# Altium schematic sheet 4_preamp.SchDoc
size A; SheetNumber: 3; SheetTotal: 7
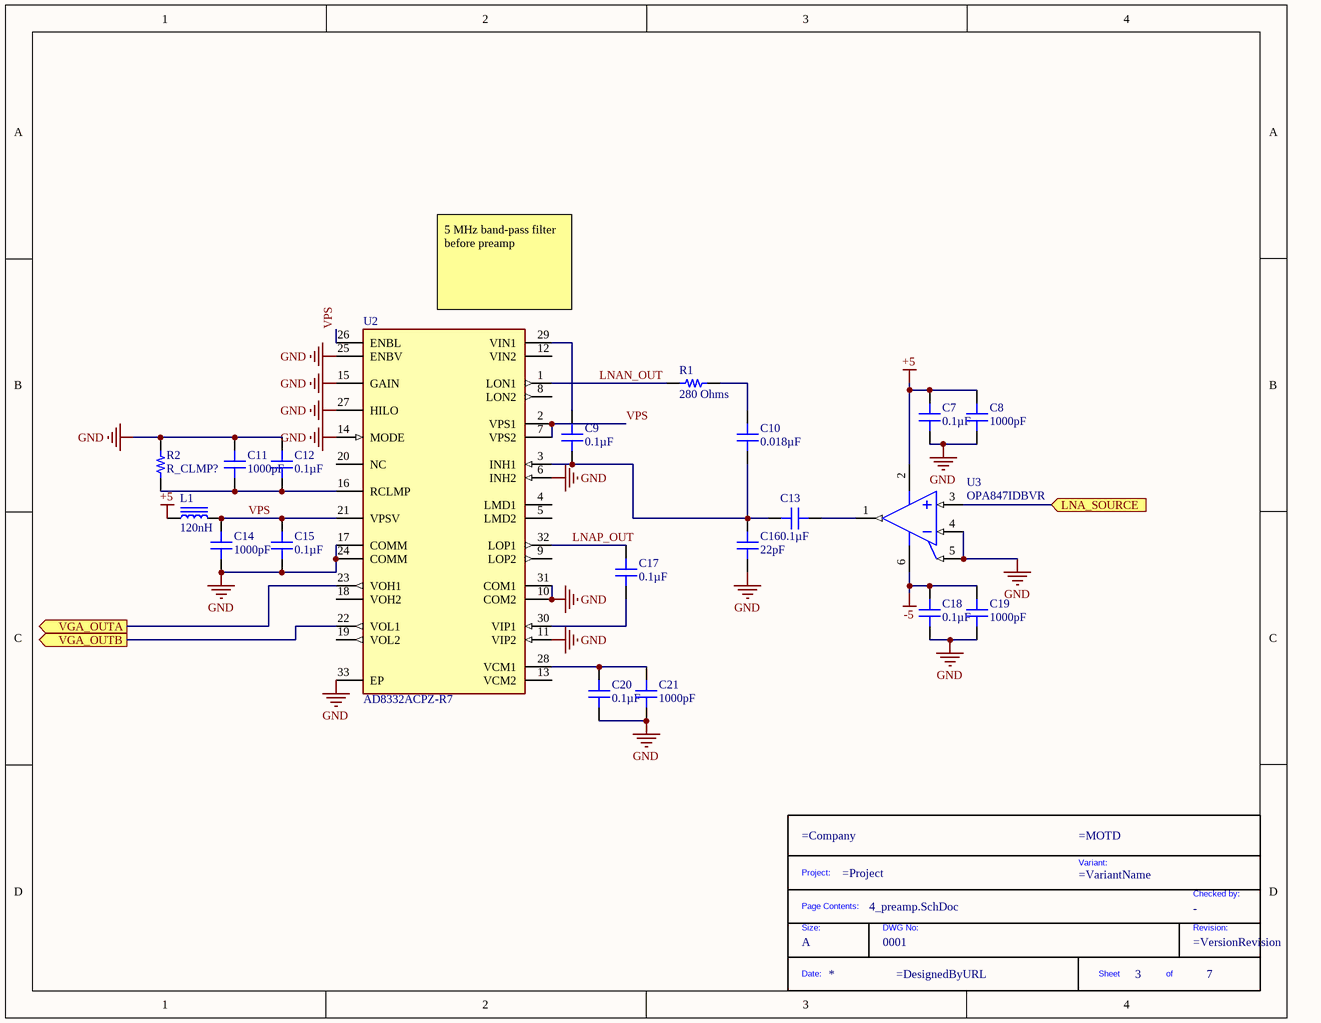
[diagram p0: 4_preamp.SchDoc]

## Parts
*?  DWG No: 0001  Size: A  (hidden comment: TitleBlock)  (graphical)
C7  0.1µF  [CAP 1206_3216 - 1.0MM]
C8  1000pF  [CAP 1206_3216 - 1.2MM]
C9  0.1µF  [CAP 1206_3216 - 1.0MM]
C10  0.018µF  [CAP 1206_3216 - 1.0MM]
C11  1000pF  [CAP 1206_3216 - 1.2MM]
C12  0.1µF  [CAP 1206_3216 - 1.0MM]
C13  0.1µF  [CAP 1206_3216 - 1.0MM]
C14  1000pF  [CAP 1206_3216 - 1.2MM]
C15  0.1µF  [CAP 1206_3216 - 1.0MM]
C16  22pF  [CAP 1206_3216 - 1.0MM]
C17  0.1µF  [CAP 1206_3216 - 1.0MM]
C18  0.1µF  [CAP 1206_3216 - 1.0MM]
C19  1000pF  [CAP 1206_3216 - 1.2MM]
C20  0.1µF  [CAP 1206_3216 - 1.0MM]
C21  1000pF  [CAP 1206_3216 - 1.2MM]
L1  120nH  [IND 0603_1608 RF WW]
R1  280 Ohms  [RES 1206_3216]
R2  R_CLMP?  [RES 1206_3216]
U2  AD8332ACPZ-R7  [FP-CP-32-7-IPC_A]
U3  OPA847IDBVR  [DBV0006A_L]

## Ports
LNA_SOURCE (in), VGA_OUTA (out), VGA_OUTB (out)

## Nets
+5: C7.2 C8.2 L1.1 U3.2(VS-)
-5: C18.2 C19.2 U3.6(VS+)
GND: C7.1 C8.1 C11.2 C12.2 C14.1 C15.1 C16.2 C18.1 C19.1 C20.1 C21.1 R2.2 U2.6(INH2) U2.10(COM2) U2.11(VIP2) U2.14(MODE) U2.15(GAIN) U2.17(COMM) U2.24(COMM) U2.25(ENBV) U2.27(HILO) U2.31(COM1) U2.33(EP) U3.4(IN-) U3.5(~{DIS})
LNA_SOURCE: U3.3(IN+) ; port LNA_SOURCE
LNAN_OUT: R1.2 U2.1(LON1)
LNAP_OUT: C17.1 U2.32(LOP1)
VGA_OUTA: U2.23(VOH1) ; port VGA_OUTA
VGA_OUTB: U2.22(VOL1) ; port VGA_OUTB
VPS: C14.2 C15.2 L1.2 U2.2(VPS1) U2.7(VPS2) U2.21(VPSV) U2.26(ENBL)
NetC9_1: C9.1 U2.29(VIN1)
NetC9_2: C9.2 C10.2 C13.1 C16.1 U2.3(INH1)
NetC10_1: C10.1 R1.1
NetC11_1: C11.1 C12.1 R2.1 U2.16(RCLMP)
NetC13_2: C13.2 U3.1(OUT)
NetC17_2: C17.2 U2.30(VIP1)
NetC20_2: C20.2 C21.2 U2.28(VCM1)

Not connected (* = marked no-connect by the designer): U2 4(LMD1) 5(LMD2) 8(LON2) 9(LOP2) 12(VIN2) 13(VCM2) 18(VOH2) 19(VOL2) 20(NC)

## Notes on the sheet
- (near U2) 5 MHz band-pass filter before preamp
- (in symbol TitleBlock) Project:; Variant:; Checked by:; Page Contents:; Size:; DWG No:; Revision:; Date:; Sheet; of

## Library data of the parts
*? = TitleBlock: Standard Title Block; Checked by: -
C7 C9 C12 C13 C15 C17 C18 C20 = 12065C104JAT2A: CAP CER 0.1UF 50V X7R 1206; manufacturer: AVX Corporation; Tolerance: ±5%; Part Number: 12065C104JAT2A; Value: 0.1µF; Applications: General Purpose; Capacitance: 0.1µF; componentlink1description: Datasheet; componentlink1url: http://datasheets.avx.com/X7RDielectric.pdf; componentlink2description: DigiKey Link; componentlink2url: http://digikey.com/product-detail/en/avx-corporation/12065C104JAT2A/478-3797-1-ND/1116495; Device Package: 1206 (3216 Metric); lastupdated: 2020-09-02 01:05:06; Lifecycle Status: Active; Minimum Order: 1; Mounting Type: Surface Mount, MLCC; Operating Temperature: -55°C ~ 125°C; Package / Case: 1206 (3216 Metric); packaging: TapeAndReel; partid: 19088; Part Status: Active; price: 0.06; series: -; Size / Dimension: 0.126" L x 0.063" W (3.20mm x 1.60mm); Supplier 1: DigiKey; Supplier Part Number 1: 478-3797-1-ND; Temperature Coefficient: X7R; Thickness (Max): 0.037" (0.94mm); Voltage - Rated: 50V
C8 C11 C14 C19 C21 = 12067C102KAT2A: CAP CER 1000PF 500V X7R 1206; manufacturer: AVX Corporation; Tolerance: ±10%; Part Number: 12067C102KAT2A; Value: 1000pF; Applications: General Purpose; Capacitance: 1000pF; componentlink1description: Datasheet; componentlink1url: http://datasheets.avx.com/X7RDielectric.pdf; componentlink2description: DigiKey Link; componentlink2url: http://digikey.com/product-detail/en/avx-corporation/12067C102KAT2A/478-3805-1-ND/1116503; Device Package: 1206 (3216 Metric); lastupdated: 2020-09-02 01:05:09; Lifecycle Status: Active; Minimum Order: 1; Mounting Type: Surface Mount, MLCC; Operating Temperature: -55°C ~ 125°C; Package / Case: 1206 (3216 Metric); packaging: TapeAndReel; partid: 19161; Part Status: Active; price: 0.09; series: -; Size / Dimension: 0.126" L x 0.063" W (3.20mm x 1.60mm); Supplier 1: DigiKey; Supplier Part Number 1: 478-3805-1-ND; Temperature Coefficient: X7R; Thickness (Max): 0.040" (1.02mm); Voltage - Rated: 500V
C10 = 12061C183KAT2A: CAP CER 0.018UF 100V X7R 1206; manufacturer: AVX Corporation; Tolerance: ±10%; Part Number: 12061C183KAT2A; Value: 0.018µF; Applications: General Purpose; Capacitance: 0.018µF; componentlink1description: Datasheet; componentlink1url: http://datasheets.avx.com/X7RDielectric.pdf; componentlink2description: DigiKey Link; componentlink2url: http://digikey.com/product-detail/en/avx-corporation/12061C183KAT2A/478-10859-1-ND/7536389; Device Package: 1206 (3216 Metric); lastupdated: 2020-09-02 01:05:02; Lifecycle Status: Active; Minimum Order: 1; Mounting Type: Surface Mount, MLCC; Operating Temperature: -55°C ~ 125°C; Package / Case: 1206 (3216 Metric); packaging: TapeAndReel; partid: 19920; Part Status: Active; price: 0.05; series: -; Size / Dimension: 0.126" L x 0.063" W (3.20mm x 1.60mm); Supplier 1: DigiKey; Supplier Part Number 1: 478-10859-1-ND; Temperature Coefficient: X7R; Thickness (Max): 0.037" (0.94mm); Voltage - Rated: 100V
C16 = 12065A220JAT2A: CAP CER 22PF 50V C0G/NP0 1206; manufacturer: AVX Corporation; Temperature Coefficient: C0G, NP0; Tolerance: ±5%; Part Number: 12065A220JAT2A; Value: 22pF; Applications: General Purpose; Capacitance: 22pF; componentlink1description: Datasheet; componentlink1url: http://datasheets.avx.com/C0GNP0-Dielectric.pdf; componentlink2description: DigiKey Link; componentlink2url: http://digikey.com/product-detail/en/avx-corporation/12065A220JAT2A/478-1472-1-ND/564504; Device Package: 1206 (3216 Metric); lastupdated: 2020-09-02 01:04:55; Lifecycle Status: Active; Minimum Order: 1; Mounting Type: Surface Mount, MLCC; Operating Temperature: -55°C ~ 125°C; Package / Case: 1206 (3216 Metric); packaging: TapeAndReel; partid: 21165; Part Status: Active; price: 0.07; series: -; Size / Dimension: 0.126" L x 0.063" W (3.20mm x 1.60mm); Supplier 1: DigiKey; Supplier Part Number 1: 478-1472-1-ND; Thickness (Max): 0.037" (0.94mm); Voltage - Rated: 50V
L1 = LQW18CAR12J00D: FIXED IND 120NH 1500MA 58MOHM; Manufacturer: Murata Electronics; Current Rating (Amps): 1.5A; DC Resistance (DCR): 58mOhm Max; Frequency - Self Resonant: 1.5GHz; Inductance Frequency - Test: 10MHz; Material - Core: Ferrite; Shielding: Unshielded; Tolerance: ±5%; Type: Wirewound; Part Number: LQW18CAR12J00D; ComponentLink1Description: Datasheet; ComponentLink1URL: https://search.murata.co.jp/Ceramy/image/img/P02/JELF243A-0159.pdf; ComponentLink2Description: DigiKey Link; ComponentLink2URL: http://digikey.com/product-detail/en/murata-electronics/LQW18CAR12J00D/490-18177-1-ND/9742079; Device Package: 0603 (1608 Metric); Height - Seated (Max): 0.037" (0.95mm); Inductance: 120nH; LastUpdated: 2020-09-06 11:05:19; Lifecycle Status: Active; Minimum Order: 1; Mounting Type: Surface Mount; Operating Temperature: -40°C ~ 85°C; Package / Case: 0603 (1608 Metric); Packaging: TapeAndReel; PartId: 1197; Part Status: Active; Price: 0.22; Series: LQW18; Size / Dimension: 0.063" L x 0.031" W (1.60mm x 0.80mm); Supplier 1: DigiKey; Supplier Part Number 1: 490-18177-1-ND; Supplier Device Package: 0603; Value: 120nH
R1 = ERJ-8ENF2800V: RES SMD 280 OHM 1% 1/4W 1206; Manufacturer: Panasonic Electronic Components; Power (Watts): 0.25W, 1/4W; Temperature Coefficient: ±100ppm/°C; Part Number: ERJ-8ENF2800V; ComponentLink1Description: Datasheet; ComponentLink1URL: https://industrial.panasonic.com/cdbs/www-data/pdf/RDA0000/AOA0000C304.pdf; ComponentLink2Description: DigiKey Link; ComponentLink2URL: https://www.digikey.com/en/products/detail/panasonic-electronic-components/ERJ-8ENF2800V/88757; Composition: Thick Film; Device Package: 1206 (3216 Metric); Features: Automotive AEC-Q200; Height - Seated (Max): 0.028" (0.70mm); LastUpdated: 2022-09-19 13:28:39; Lifecycle Status: Active; Minimum Order: 1; Number of Terminations: 2; Operating Temperature: -55°C ~ 155°C; Package / Case: 1206 (3216 Metric); Packaging: TapeAndReel; PartId: 43874; Part Status: Active; Price: 0.02; Ratings: AEC-Q200; Resistance: 280 Ohms; Series: ERJ-8EN; Size / Dimension: 0.126" L x 0.063" W (3.20mm x 1.60mm); Supplier 1: DigiKey; Supplier Part Number 1: P280FCT-ND; Supplier Device Package: 1206; Tolerance: ±1%; Value: 280 Ohms
R2 = RNCP1206FTD1K00: RES 1K OHM 1% 1/2W 1206; Manufacturer: Stackpole Electronics Inc; Power (Watts): 0.5W, 1/2W; Resistance: 1 kOhms; Temperature Coefficient: ±100ppm/°C; Value: 1 kOhms; Part Number: RNCP1206FTD1K00; ComponentLink1Description: Datasheet; ComponentLink1URL: https://www.seielect.com/catalog/sei-rncp.pdf; ComponentLink2Description: DigiKey Link; ComponentLink2URL: https://www.digikey.com/en/products/detail/stackpole-electronics-inc/RNCP1206FTD1K00/2240337; Composition: Thin Film; Device Package: 1206 (3216 Metric); Features: Anti-Sulfur; Height - Seated (Max): 0.025" (0.65mm); LastUpdated: 2022-09-19 13:29:57; Lifecycle Status: Active; Minimum Order: 1; Number of Terminations: 2; Operating Temperature: -55°C ~ 155°C; Package / Case: 1206 (3216 Metric); Packaging: TapeAndReel; PartId: 26970; Part Status: Active; Price: 0.01; Series: RNCP; Size / Dimension: 0.122" L x 0.059" W (3.10mm x 1.50mm); Supplier 1: DigiKey; Supplier Part Number 1: RNCP1206FTD1K00CT-ND; Supplier Device Package: 1206; Tolerance: ±1%
U2 = CMP-09116-000345-1: IC VGAIN AMP 32LFCSP; Operating Supply Current: 58mA; -3db Bandwidth: 120MHz; Voltage Gain: 19dB; Power Supply Rejection Ratio (PSRR): 68dB; Power Dissipation: 1.97W; Number of Channels: 2; Gain: 55dB; Noise Figure: 4.2dB; Slew Rate: 650V/µs; Bandwidth: 100MHz; Min Supply Voltage: 4.5V; Max Supply Voltage: 5.5V; Input Offset Voltage (Vos): 50mV; Operating Supply Voltage: 5V; Input Resistance: 6kR; Case/Package: LFCSP EP; Contact Plating: Tin; Mount: Surface Mount; Package Quantity: 1500; Lead Free: Contains Lead; RoHS Compliant: Yes; Packaging: Tape and Reel; Series: X-AMP®; Min Operating Temperature: -40°C; REACH SVHC: No SVHC; Length: 5mm; Gain Bandwidth Product: 120MHz; Number of Pins: 32; Height: 0.8mm; Max Operating Temperature: 85°C; Radiation Hardening: No; Number of Amplifiers: 2; Width: 5mm; Number of Elements: 2
U3 = CMP-0018-00482-2: Wideband, Ultra-Low Noise, Voltage Feedback Operational Amplifier with Shutdown, 10 to 12 V, -40 to 85 degC, 6-pin SOT23 (DBV6), Green (RoHS & no Sb/Br); Manufacturer: Texas Instruments; Vs(Min)(V): 10; Settling Time (0.1%)(Typ)(ns): 20; Number of Channels: 1; THD (Fc is 1 MHz)(Typ)(dB): -96; Iib(Max)(nA): 42000; @ MHz: 5; Iq per channel(Max)(mA): 18.9; 2nd Harmonic(dBc): 105; Io(Typ)(mA): 75; Vn at Flatband(Typ)(nV/rtHz): 0.85; 3rd Harmonic(dBc): 110; Vio(Max)(mV): 0.5; Slew Rate(Typ)(V/us): 950; Acl, min stable gain(V/V): 12; Sub Family: High Output Current Amplifier (>=50mA), High Speed Amplifier (>=50MHz), Low Offset Voltage Amplifier (<=500uV); BW @ Acl(MHz): 600; Mounting Technology: Surface Mount; ComponentLink2URL: http://www.ti.com/general/docs/lit/getliterature.tsp?genericPartNumber=OPA847&fileType=pdf; Eco-Plan: Green (RoHS & no Sb/Br); ComponentLink2Description: Datasheet; Code_JEDEC: MO-178; PackageVersion: 4073253-5/K, 03/2006; PackageDescription: 6-Pin Plastic Small Outline, Body 1.6 x 2.9 mm, Pitch 0.95 mm; DatasheetVersion: SBOS251E; PartNumber: OPA847IDBVR; ComponentLink1Description: Manufacturer URL; ComponentLink3Description: Package Specification; ComponentLink3URL: http://www.ti.com/litv/pdf/mpds026h; ComponentLink1URL: http://www.ti.com/; Vs(Max)(V): 12; PackageReference: DBV0006A